# Altium schematic sheet basecontrol3.SchDoc
size A4
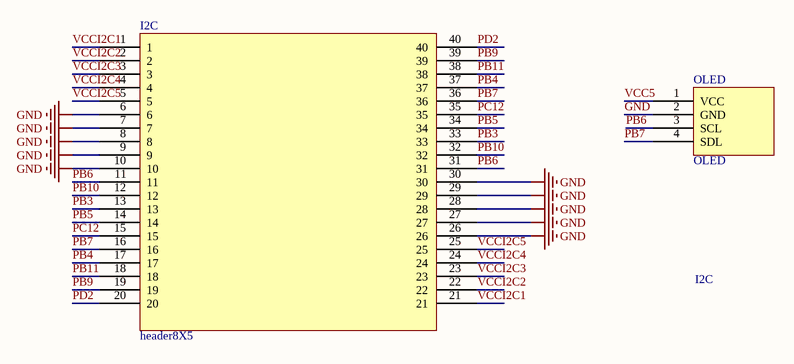
[diagram p0: basecontrol3.SchDoc]

## Parts
I2C  header8X5  [header8X5]
OLED  OLED  [OLED_12864]

## Nets
GND: I2C.6 I2C.7 I2C.8 I2C.9 I2C.10 I2C.26 I2C.27 I2C.28 I2C.29 I2C.30 OLED.2(GND)
PB3: I2C.13 I2C.33
PB4: I2C.17 I2C.37
PB5: I2C.14 I2C.34
PB6: I2C.11 I2C.31 OLED.3(SCL)
PB7: I2C.16 I2C.36 OLED.4(SDL)
PB9: I2C.19 I2C.39
PB10: I2C.12 I2C.32
PB11: I2C.18 I2C.38
PC12: I2C.15 I2C.35
PD2: I2C.20 I2C.40
VCC5: OLED.1(VCC)
VCCI2C1: I2C.1 I2C.21
VCCI2C2: I2C.2 I2C.22
VCCI2C3: I2C.3 I2C.23
VCCI2C4: I2C.4 I2C.24
VCCI2C5: I2C.5 I2C.25

## Notes on the sheet
- I2C

## Library data of the parts
OLED = OLED_12864